# EAGLE design BLE112 Breakout Board v2.2 (EAGLE 7.2.0)
BLE112 Breakout Board v2.0 Full breakout board for all BLE112 functions, with optional LEDs, programming header, USB access, etc.
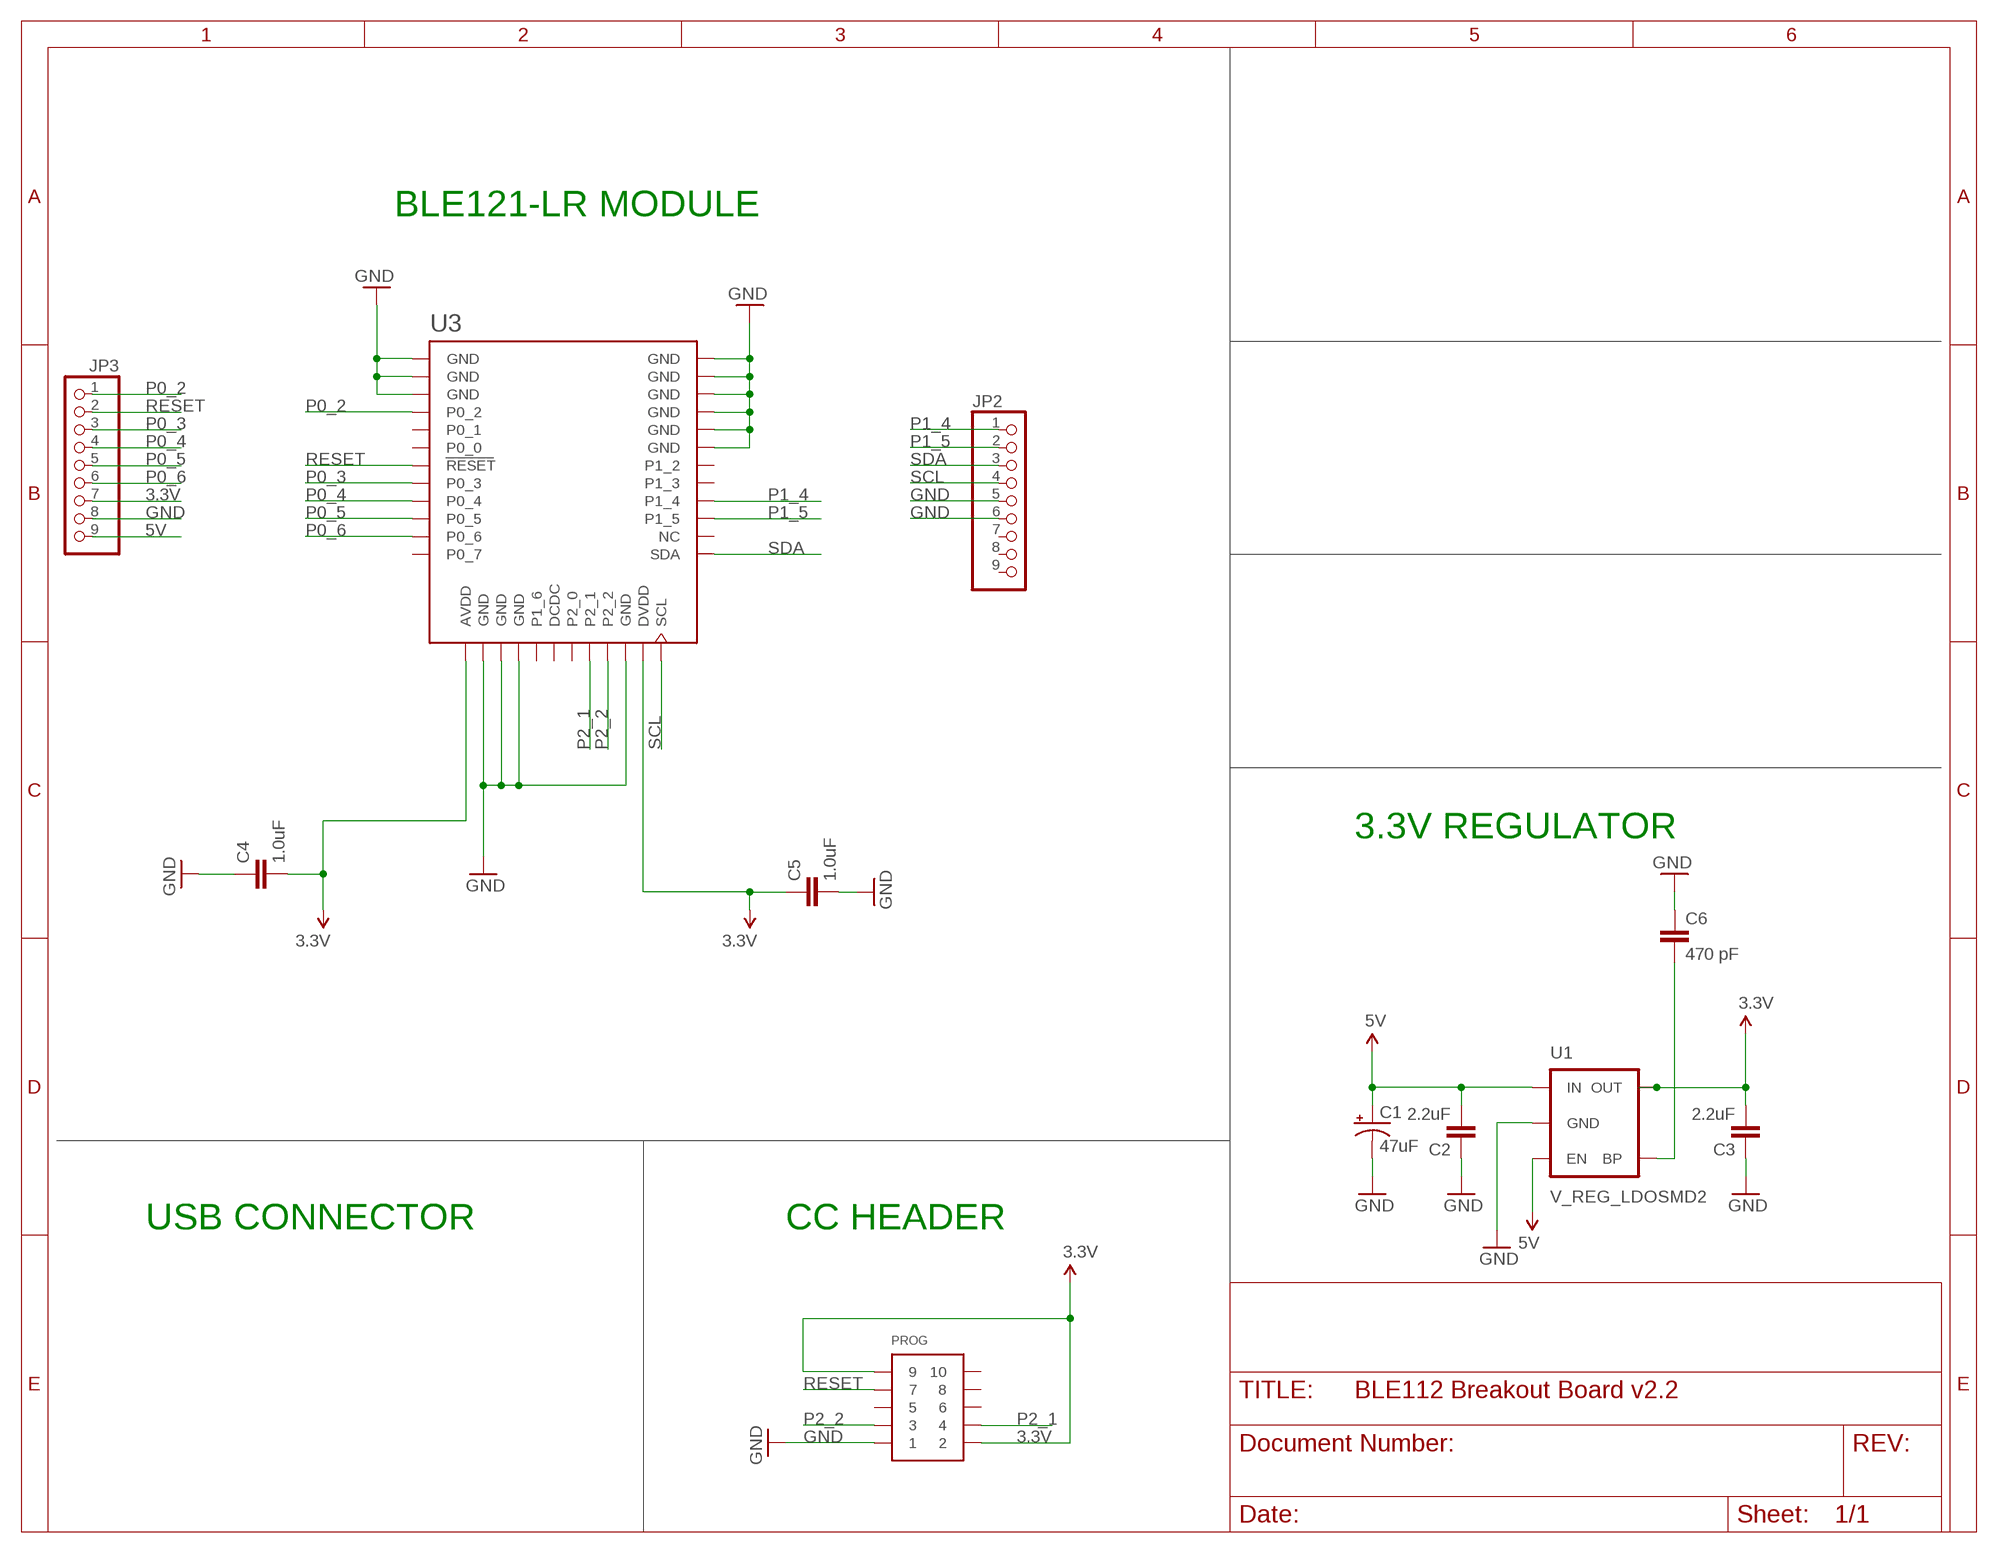
[diagram p0: schematic, sheet 1]

## Parts
C1  47uF  47UF-50V-20%(ELECT)  [PANASONIC_D]
C2  2.2uF  1.0UF-16V-10%(0402)  [0402-CAP]
C3  2.2uF  1.0UF-16V-10%(0402)  [0402-CAP]
C4  1.0uF  1.0UF-16V-10%(0402)  [0402-CAP]
C5  1.0uF  1.0UF-16V-10%(0402)  [0402-CAP]
C6  470 pF  CAP0402-CAP  [0402-CAP]
JP2  PINHD-1X9  [1X09-BIG]
JP3  PINHD-1X9  [1X09-BIG]
PROG  CONN_5-2-FTSH-V  [FTSH-105-DV]
U1  V_REG_LDOSMD2  [SC70]
U3  BLE121LR-VISUAL-A  [BLE121LR-A]

## Nets
3.3V [power]: C3.2 C4.2 C5.1 JP3.7 PROG.2 PROG.9 U1.5(OUT) U3.AVDD U3.DVDD
5V [power]: C1.+ C2.2 JP3.9 U1.1(IN) U1.3(EN)
GND [power]: C1.- C2.1 C3.1 C4.1 C5.2 C6.1 JP2.5 JP2.6 JP3.8 PROG.1 U1.2(GND) U3.GND U3.GND@2(GND) U3.GND@3(GND) U3.GND@4(GND) U3.GND@5(GND) U3.GND@6(GND) U3.GND@7(GND) U3.GND@8(GND) U3.GND@9(GND) U3.GND@10(GND) U3.GND@11(GND) U3.GND@12(GND) U3.GND@13(GND)
N$1: C6.2 U1.4(BP)
P0_2: JP3.1 U3.P0_2
P0_3: JP3.3 U3.P0_3
P0_4: JP3.4 U3.P0_4
P0_5: JP3.5 U3.P0_5
P0_6: JP3.6 U3.P0_6
P1_4: JP2.1 U3.P1_4
P1_5: JP2.2 U3.P1_5
P2_1: PROG.4 U3.P2_1
P2_2: PROG.3 U3.P2_2
RESET: JP3.2 PROG.7 U3.RESET
SCL: JP2.4 U3.SCL
SDA: JP2.3 U3.SDA
Unconnected: JP2.7 JP2.8 JP2.9 PROG.5 PROG.6 PROG.8 PROG.10 U3.DCDC U3.NC U3.P0_0 U3.P0_1 U3.P0_7 U3.P1_2 U3.P1_3 U3.P1_6 U3.P2_0

## Notes on the sheet
- BLE121-LR MODULE
- 3.3V REGULATOR
- USB CONNECTOR | CC HEADER

## Library data of the parts
C1 = SparkFun-Capacitors:47UF-50V-20%(ELECT): CAP-10547; PROD_ID: CAP-10547
C2 C3 = SparkFun-Capacitors:1.0UF-16V-10%(0402); PROD_ID: CAP-12417; VALUE: 1.0uF
C4 C5 = SparkFun-Capacitors:1.0UF-16V-10%(0402); PROD_ID: CAP-12417
C6 = SparkFun-Capacitors:CAP: Capacitor Standard 0603 ceramic capacitor, and 0.1" leaded capacitor.
JP2 JP3 = adafruit:PINHD-1X9: Pin header 1x10 0.1" spacing With round pins
PROG = pel_misc:CONN_5-2
U1 = SparkFun-PowerIC:V_REG_LDO: Voltage Regulator LDO Standard 150mA LDO voltage regulator in SOT-23 layout. Micrel part MIC5205. BP (by-pass) pin is used to lower output noise with 470pF cap.
U3 = sf-bluegiga:BLE121LR-VISUAL: Bluetooth Low Energy single-mode long-range module - Bluetooth 4.0 (CC2541). BLE121LR-A variant has an on-module ceramic chip antenna. BLE121LR-A variant includes keepout/restrict area. Antenna edge of the module should be flush up against the edge of the PCB. See datasheet for variant layout details. IT IS EXTREMELY IMPORTANT THAT YOU FOLLOW THE LAYOUT GUIDELINES FOR THIS MODULE IN ORDER TO ENSURE MAXIMUM RANGE. THIS MEANS THAT YOU NEED A SOLID GROUND PLANE EXTENDING AT LEAST 17 mm ON THE LEFT AND RIGHT SIDES OF THE MODULE, AS SHOWN IN THE DATASHEET. BLE121LR is a Bluetooth Smart Long Range module targeted for Bluetooth Smart applications where the best possible RF performance and range are required. At +8 dBm TX power and -98 dBm sensitivity BLE121LR has best-in-class RF performance and can provide Bluetooth Smart connectivity up to 450 meters. BLE121LR integrates all features required for a Bluetooth Smart application: Bluetooth radio, software stack and GATT based profiles. and it can also host end user applications, which means no external micro controller is required in size, price or power constrained devices. BLE121LR Bluetooth Smart module also has flexible hardware interfaces to connect to different peripherals or sensors. Although BLE121LR Bluetooth Smart Long Range Module is target for applications requiring high RF performance, it is still has relatively low power consumption and can be power using a standard 3V coin cell batteries. https://www.bluegiga.com/en-US/products/bluetooth-4.0-modules/ble121lr-bluetooth--smart-long https://github.com/jrowberg/sf-oshw Last updated 2014-08-02 by Jeff Rowberg <jeff@rowberg.net>; ANTENNA: On-module ceramic chip antenna

## Net classes
0 default: width 0.152 mm, drill 0.33 mm, clearance 0.152 mm
1 power: width 0.254 mm, drill 0.33 mm, clearance 0.152 mm

## Board
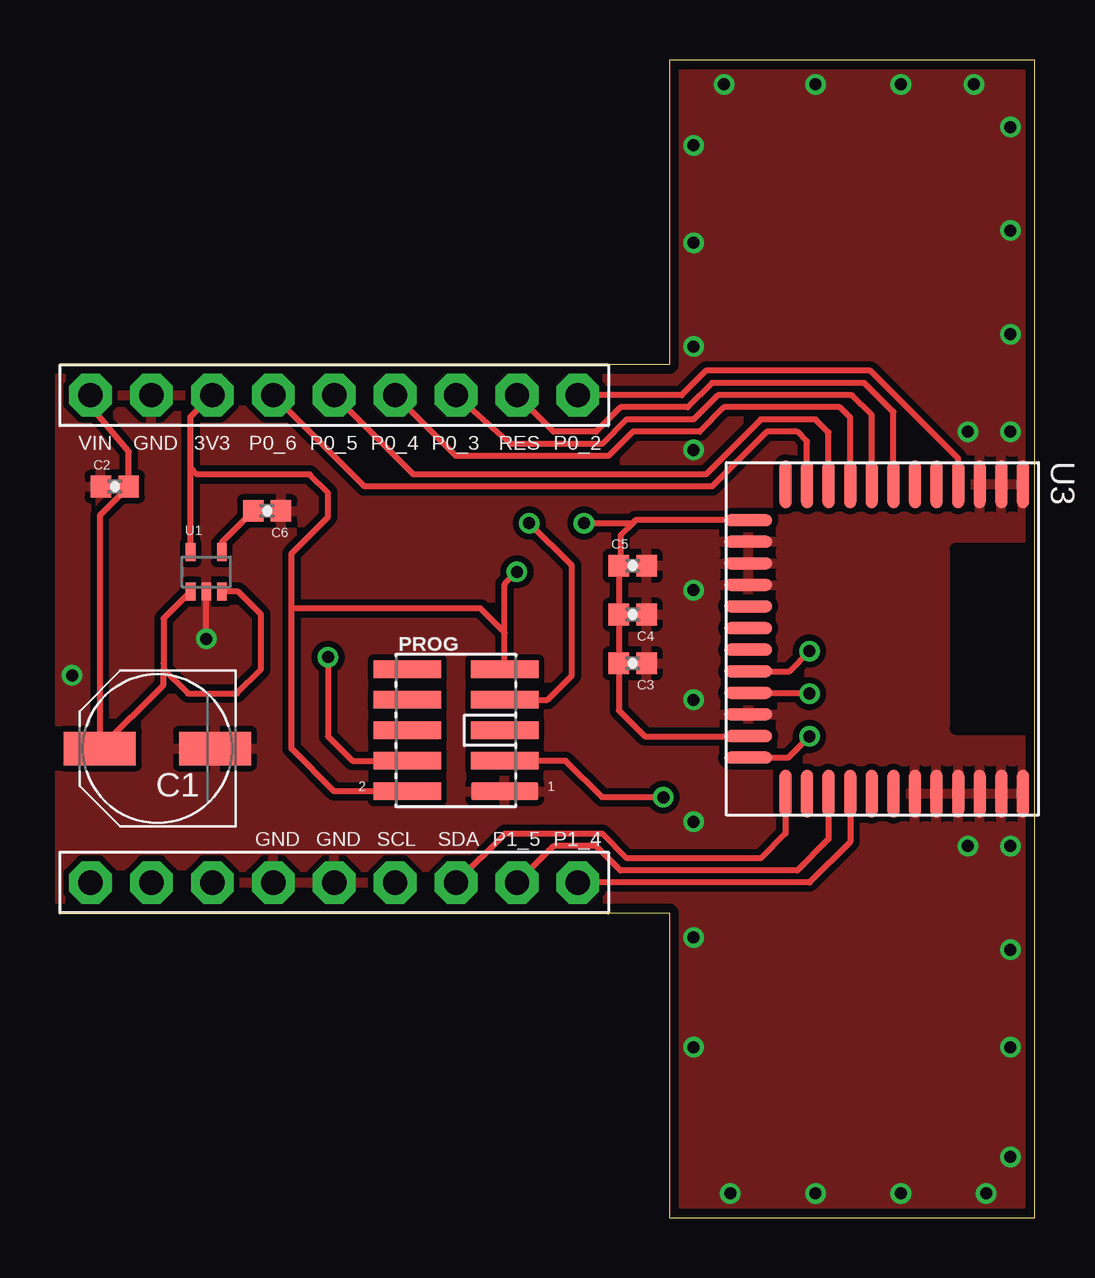
[diagram p1: board, top side]
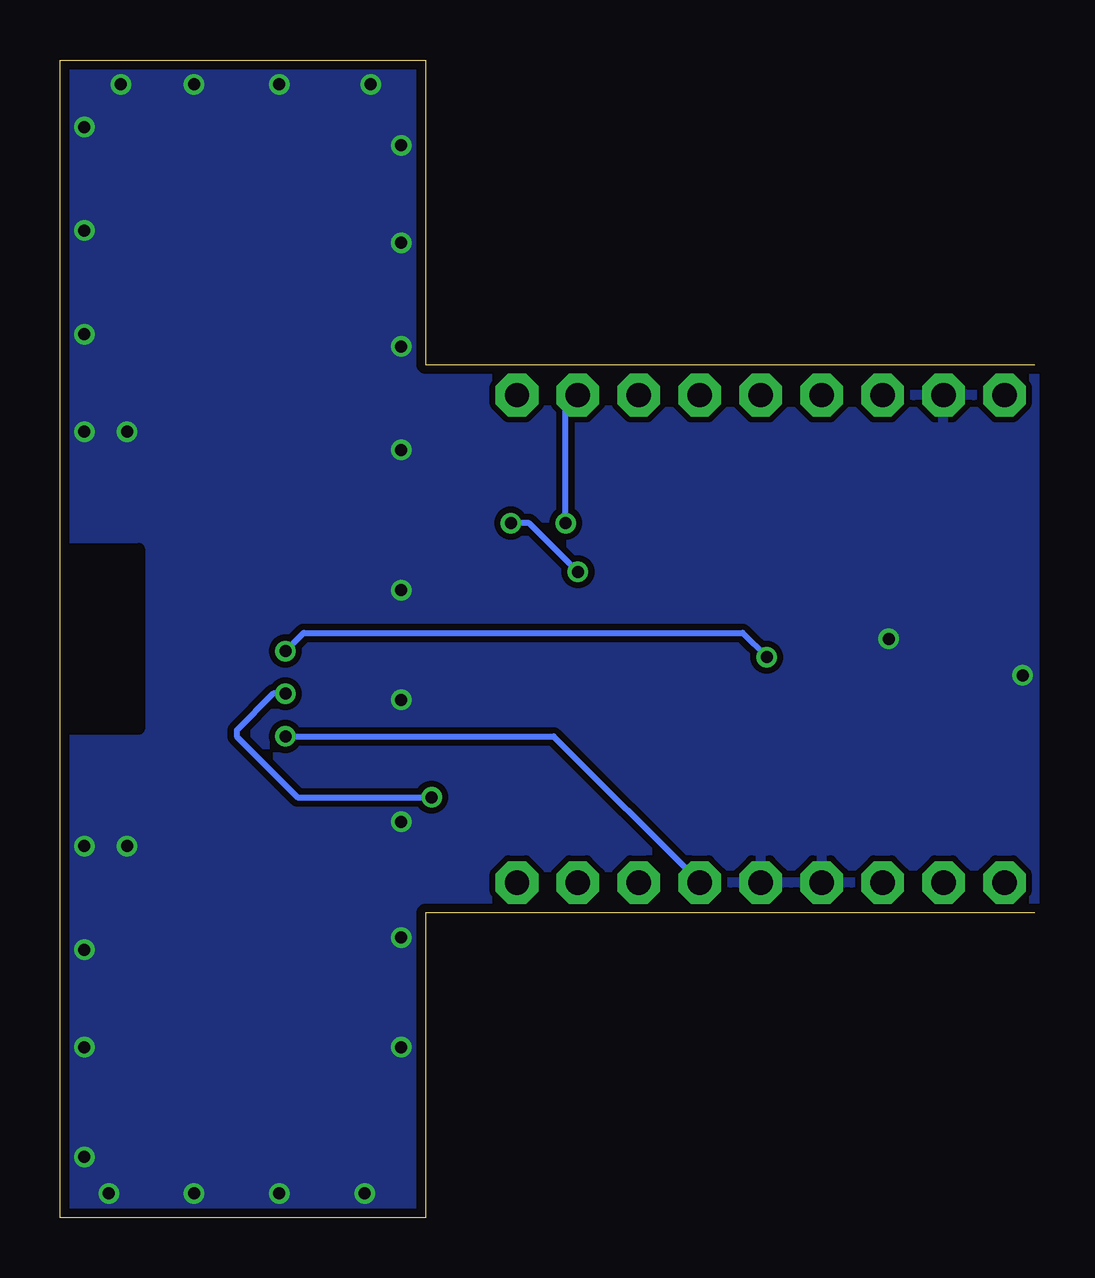
[diagram p2: board, bottom side, seen from below]

Size 40.64 x 48.26 mm. Coordinates in mm from the lower left corner, seen from the top.
Outline: 0,12.7 25.4,12.7 25.4,0 40.64,0 40.64,48.26 25.4,48.26 25.4,35.56 0,35.56
Copper layers (1*16): Top 0.0356mm / dielectric 1.5011mm / Bottom 0.0356mm
Design rules "default": minimum track width 6mil, minimum drill 13mil, track to track 6mil, track to pad 6mil, pad to pad 6mil, via to via 6mil, smd to smd 6mil, copper to edge 15mil, drill to drill 6mil, minimum pad ring 7mil, minimum via ring 7mil, stop-mask expansion 4mil, vias tented up to drill 13mil, thermal gap 10mil

### Footprints (pad centres in the part's own frame; a part is rotated, then mirrored left to right if it is on the bottom)
PANASONIC_D = smd 3 x 1.4: + 2.4,0; - -2.4,0
0402-CAP = smd 0.85 x 0.9: 1 -0.58,0; 2 0.58,0
1X09-BIG = drill 1.016 pad 1.778 octagon: 1 -10.16,0; 2 -7.62,0; 3 -5.08,0; 4 -2.54,0; 5 0,0; 6 2.54,0; 7 5.08,0; 8 7.62,0; 9 10.16,0
FTSH-105-DV = smd 0.74 x 2.8: 1 -2.54,-2.03; 2 -2.54,2.03; 3 -1.27,-2.03; 4 -1.27,2.03; 5 0,-2.03; 6 0,2.03; 7 1.27,-2.03; 8 1.27,2.03; 9 2.54,-2.03; 10 2.54,2.03
SC70 = smd 0.4 x 0.75: 1 -0.65,-0.825; 2 0,-0.825; 3 0.65,-0.825; 4 0.65,0.825; 5 -0.65,0.825
BLE121LR-A = smd 0.5 x 2: AVDD -4.95,-5.6; DCDC -0.45,-5.6; DVDD 4.05,-5.6; GND@4 -4.05,-5.6; GND@5 -3.15,-5.6; GND@6 -2.25,-5.6; GND@7 3.15,-5.6; P1_6 -1.35,-5.6; P2_0 0.45,-5.6; P2_1 1.35,-5.6; P2_2 2.25,-5.6; SCL 4.95,-5.6 | smd 2 x 0.5: GND -6.45,5.85; GND@2 -6.45,4.95; GND@3 -6.45,4.05; GND@8 6.45,1.35; GND@9 6.45,2.25; GND@10 6.45,3.15; GND@11 6.45,4.05; GND@12 6.45,4.95; GND@13 6.45,5.85; NC 6.45,-3.15; P0_0 -6.45,1.35; P0_1 -6.45,2.25; P0_2 -6.45,3.15; P0_3 -6.45,-0.45; P0_4 -6.45,-1.35; P0_5 -6.45,-2.25; P0_6 -6.45,-3.15; P0_7 -6.45,-4.05; P1_2 6.45,0.45; P1_3 6.45,-0.45; P1_4 6.45,-1.35; P1_5 6.45,-2.25; RESET -6.45,0.45; SDA 6.45,-4.05

### Placement (x,y rotation side)
C1  4.06,19.56 180 top
C2  2.29,30.48 0 top
C3  23.88,23.11 180 top
C4  23.88,25.15 180 top
C5  23.88,27.18 0 top
C6  8.64,29.46 180 top
JP2  11.43,13.97 180 top
JP3  11.43,34.29 180 top
PROG  16.51,20.32 90 top
U1  6.1,26.92 0 top
U3  34.29,24.13 270 top

### Tracks (layer width: path | path; a pad name or v marks a point on that pad's centre or on a via)
3.3V  (via drill 0.5)
  Top 0.254: U1.5 5.45,31.24 | 5.45,31.24 5.45,33.39 JP3.7 | PROG.2 11.43,17.78 9.65,19.56 9.65,25.4 | 9.65,25.4 9.65,27.69 11.18,29.21 11.18,30.23 10.41,30.99 5.7,30.99 5.45,31.24 | 9.65,25.4 17.53,25.4 18.54,24.39 PROG.9 18.54,26.41 v19.05,26.92 | U3.AVDD 24,29.08 23.88,28.96 | 23.88,28.96 23.37,28.45 23.37,27.25 C5.1 C4.2 C3.2 23.3,21.15 24.38,20.07 28.68,20.07 U3.DVDD | v21.84,28.96 23.88,28.96
  Bottom 0.254: v19.05,26.92 21.08,28.96 v21.84,28.96
5V
  Top 0.254: JP3.9 1.52,34.04 1.52,33.53 2.87,31.93 C2.2 1.66,29.28 C1.+ 4.32,22.21 4.32,22.86 | U1.1 4.32,24.97 4.32,23.11 4.32,22.86 | 4.32,22.86 5.33,21.84 7.37,21.84 8.38,22.86 8.38,25.15 7.43,26.1 U1.3
GND  (via drill 0.5)
  Top 0.254: v6.1,24.13 U1.2
  other vias: 26.42,40.64 26.42,44.7 27.69,47.24 31.5,47.24 35.05,47.24 38.1,47.24 39.62,45.47 39.62,41.15 39.62,36.83 39.62,32.77 37.85,32.77 26.42,36.32 26.42,32 26.42,26.16 26.42,21.59 26.42,16.51 26.42,11.68 26.42,7.11 27.94,1.02 31.5,1.02 35.05,1.02 38.61,1.02 39.62,2.54 39.62,7.11 39.62,11.18 39.62,15.49 37.85,15.49 0.51,22.61
  pour Top (isolate 0.254): 0,35.56 25.4,35.56 25.4,48.26 40.64,48.26 40.64,0 25.4,0 25.4,12.7 0,12.7
  pour Bottom (isolate 0.254): 0,35.56 25.4,35.56 25.4,48.26 40.64,48.26 40.64,0 25.4,0 25.4,12.7 0,12.7
N$1
  Top 0.254: U1.4 6.75,28.15 C6.2
P0_2
  Top 0.254: U3.P0_2 37.44,31.65 33.78,35.31 26.92,35.31 25.91,34.29 JP3.1
P0_3
  Top 0.254: U3.P0_3 33.84,33.47 33.02,34.29 27.43,34.29 26.42,33.27 23.62,33.27 22.61,32.26 18.8,32.26 JP3.3
P0_4
  Top 0.254: U3.P0_4 32.94,33.35 32.51,33.78 27.69,33.78 26.67,32.77 23.88,32.77 22.86,31.75 16.51,31.75 JP3.4
P0_5
  Top 0.254: U3.P0_5 32.04,32.73 31.5,33.27 29.21,33.27 26.92,30.99 14.73,30.99 JP3.5
P0_6
  Top 0.254: U3.P0_6 31.14,32.36 30.73,32.77 29.46,32.77 27.18,30.48 12.7,30.48 JP3.6
P1_4
  Top 0.254: U3.P1_4 32.94,15.67 31.24,13.97 JP2.1
P1_5
  Top 0.254: U3.P1_5 32.04,15.78 30.73,14.48 23.37,14.48 22.35,15.49 20.57,15.49 JP2.2
P2_1  (via drill 0.5)
  Top 0.254: U3.P2_1 30.4,22.78 v31.24,23.62 | v11.18,23.37 11.18,20.07 12.19,19.05 PROG.4
  Bottom 0.254: v31.24,23.62 30.48,24.38 12.19,24.38 v11.18,23.37
P2_2  (via drill 0.5)
  Top 0.254: U3.P2_2 31.21,21.88 v31.24,21.84 | v25.15,17.53 22.61,17.53 21.08,19.05 PROG.3
  Bottom 0.254: v31.24,21.84 31.75,21.84 33.27,20.32 33.27,20.07 30.73,17.53 v25.15,17.53
RESET  (via drill 0.5)
  Top 0.254: U3.RESET 34.74,33.59 33.53,34.8 27.18,34.8 26.16,33.78 23.37,33.78 22.35,32.77 20.57,32.77 JP3.2 | PROG.7 20.32,21.59 21.34,22.61 21.34,27.18 v19.56,28.96
  Bottom 0.254: v19.56,28.96 19.56,33.78 JP3.2
SCL  (via drill 0.5)
  Top 0.254: U3.SCL 30.36,19.18 v31.24,20.07
  Bottom 0.254: v31.24,20.07 20.07,20.07 JP2.4
SDA
  Top 0.254: U3.SDA 30.24,16.02 29.21,14.99 23.62,14.99 22.61,16 18.54,16 JP2.3

### Text on the board
tNames: VIN | GND | 3V3 | P0_6 | P0_5 | P0_4 | P0_3 | RES | P0_2 | 2 | 1 | GND | GND | SCL | SDA | P1_5 | P1_4